# Altium project Komurindo2017.PrjPcb
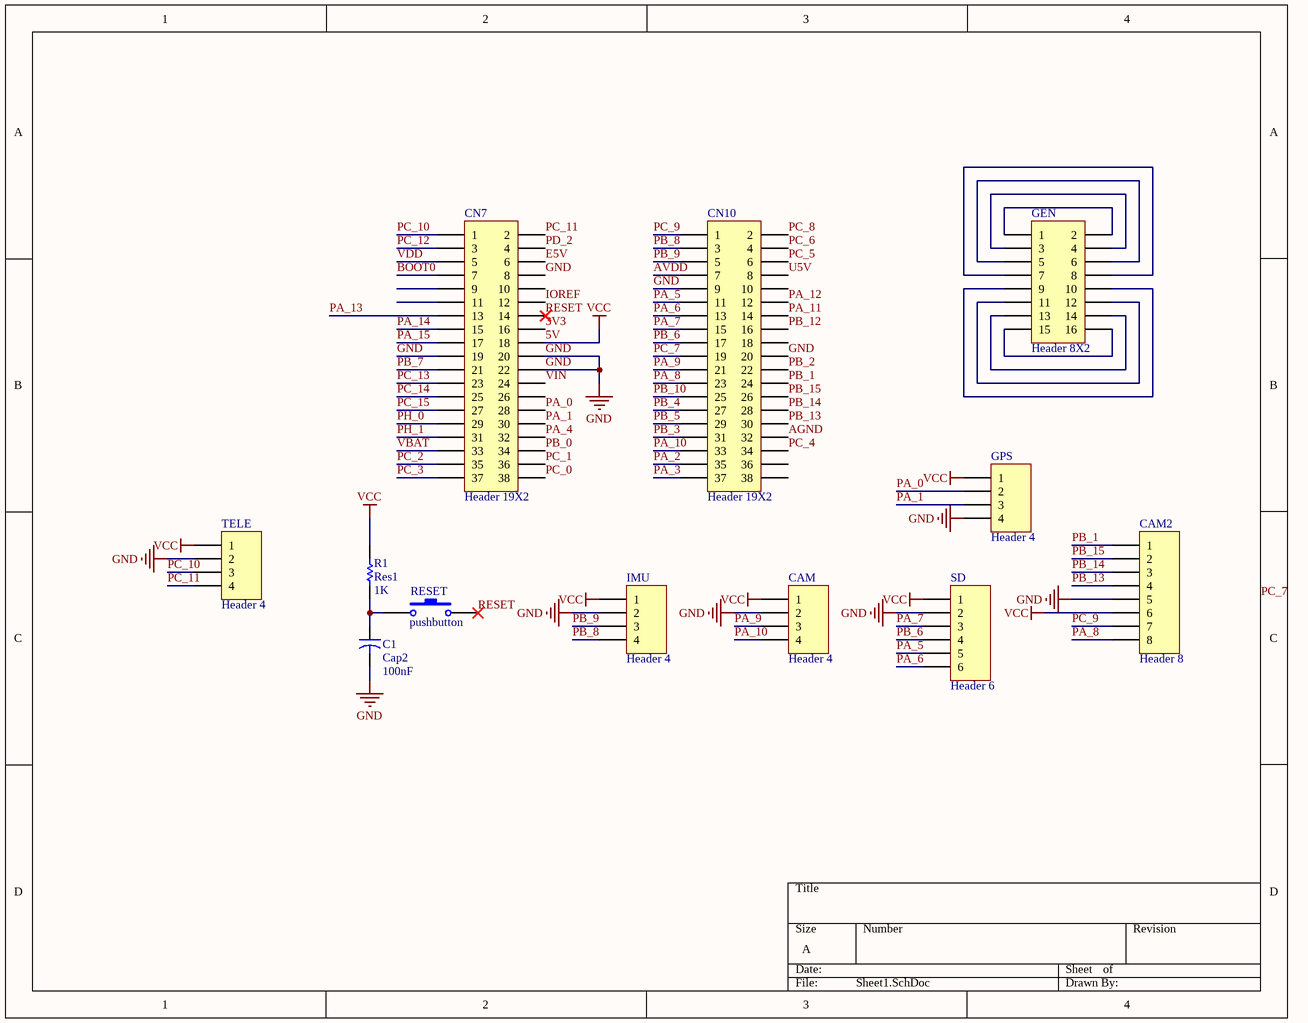
[diagram p0: Sheet1.SchDoc]
1 sheet, 12 parts. Net scope: global (net labels, ports and power ports of the same name join across sheets).
Board file: PCB1.PcbDoc

## Sheet Sheet1.SchDoc
size A

### Parts
C1  Cap2  value 100nF  [CAPR5-4X5]
CAM  Header 4  [HDR1X4]
CAM2  Header 8  [HDR1X8]
CN7  Header 19X2  [HDR2X19]
CN10  Header 19X2  [HDR2X19]
GEN  Header 8X2  [HDR2X8]
GPS  Header 4  [HDR1X4]
IMU  Header 4  [HDR1X4]
R1  Res1  value 1K  [AXIAL-0.3]
RESET  pushbutton  [pushbutton]
SD  Header 6  [HDR1X6]
TELE  Header 4  [HDR1X4]

### Nets
5V: CAM.1 CAM2.6 CN7.18 GPS.1 IMU.1 R1.2 SD.1 TELE.1  [also labelled VCC]
GND: C1.2 CAM.2 CAM2.5 CN7.8 CN7.19 CN7.20 CN7.22 CN10.9 CN10.20 GPS.4 IMU.2 SD.2 TELE.2
3V3: CN7.16
AGND: CN10.32
AVDD: CN10.7
BOOT0: CN7.7
E5V: CN7.6
IOREF: CN7.12
PA_0: CN7.28 GPS.2
PA_1: CN7.30 GPS.3
PA_2: CN10.35
PA_3: CN10.37
PA_4: CN7.32
PA_5: CN10.11 SD.5
PA_6: CN10.13 SD.6
PA_7: CN10.15 SD.3
PA_8: CAM2.8 CN10.23
PA_9: CAM.3 CN10.21
PA_10: CAM.4 CN10.33
PA_11: CN10.14
PA_12: CN10.12
PA_13: CN7.13
PA_14: CN7.15
PA_15: CN7.17
PB_0: CN7.34
PB_1: CAM2.1 CN10.24
PB_2: CN10.22
PB_3: CN10.31
PB_4: CN10.27
PB_5: CN10.29
PB_6: CN10.17 SD.4
PB_7: CN7.21
PB_8: CN10.3 IMU.4
PB_9: CN10.5 IMU.3
PB_10: CN10.25
PB_12: CN10.16
PB_13: CAM2.4 CN10.30
PB_14: CAM2.3 CN10.28
PB_15: CAM2.2 CN10.26
PC_0: CN7.38
PC_1: CN7.36
PC_2: CN7.35
PC_3: CN7.37
PC_4: CN10.34
PC_5: CN10.6
PC_6: CN10.4
PC_7: CN10.19
PC_8: CN10.2
PC_9: CAM2.7 CN10.1
PC_10: CN7.1 TELE.3
PC_11: CN7.2 TELE.4
PC_12: CN7.3
PC_13: CN7.23
PC_14: CN7.25
PC_15: CN7.27
PD_2: CN7.4
PH_0: CN7.29
PH_1: CN7.31
RESET: CN7.14 RESET.2
U5V: CN10.8
VBAT: CN7.33
VDD: CN7.5
VIN: CN7.24
NetC1_1: C1.1 R1.1 RESET.1
NetGEN_1: GEN.1 GEN.2
NetGEN_3: GEN.3 GEN.4
NetGEN_5: GEN.5 GEN.6
NetGEN_7: GEN.7 GEN.8
NetGEN_9: GEN.9 GEN.10
NetGEN_11: GEN.11 GEN.12
NetGEN_13: GEN.13 GEN.14
NetGEN_15: GEN.15 GEN.16

Not connected (* = marked no-connect by the designer): CN7 9 10 11 26; CN10 10 18 36 38

### Notes on the sheet
- Labels drawn without touching a wire or pin: PC_7

### Library data of the parts
C1 = Cap2: Capacitor; Published: 23-Sep-2002; PackageReference: CAPR5-4X5; Publisher: Altium Limited; PackageDescription: Capacitor; 2 Leads
CAM GPS IMU TELE = Header 4: Header, 4-Pin; LatestRevisionDate: 17-Jul-2002; LatestRevisionNote: Re-released for DXP Platform.; Publisher: Altium Limited
CAM2 = Header 8: Header, 8-Pin; LatestRevisionDate: 17-Jul-2002; LatestRevisionNote: Re-released for DXP Platform.; Publisher: Altium Limited
CN7 CN10 = Header 19X2: Header, 19-Pin, Dual row; LatestRevisionDate: 17-Jul-2002; LatestRevisionNote: Re-released for DXP Platform.; Publisher: Altium Limited
GEN = Header 8X2: Header, 8-Pin, Dual row; LatestRevisionDate: 17-Jul-2002; LatestRevisionNote: Re-released for DXP Platform.; Publisher: Altium Limited
R1 = Res1: Resistor; Published: 8-Jun-2000; LatestRevisionDate: 17-Jul-2002; LatestRevisionNote: Re-released for DXP Platform.; PackageReference: AXIAL-0.3; Publisher: Altium Limited; PackageDescription: Axial Device, Thru-Hole; 2 Leads; 0.3 in Pin Spacing
SD = Header 6: Header, 6-Pin; LatestRevisionDate: 17-Jul-2002; LatestRevisionNote: Re-released for DXP Platform.; Publisher: Altium Limited